# Altium project CM4_IO_Board.PrjPcb
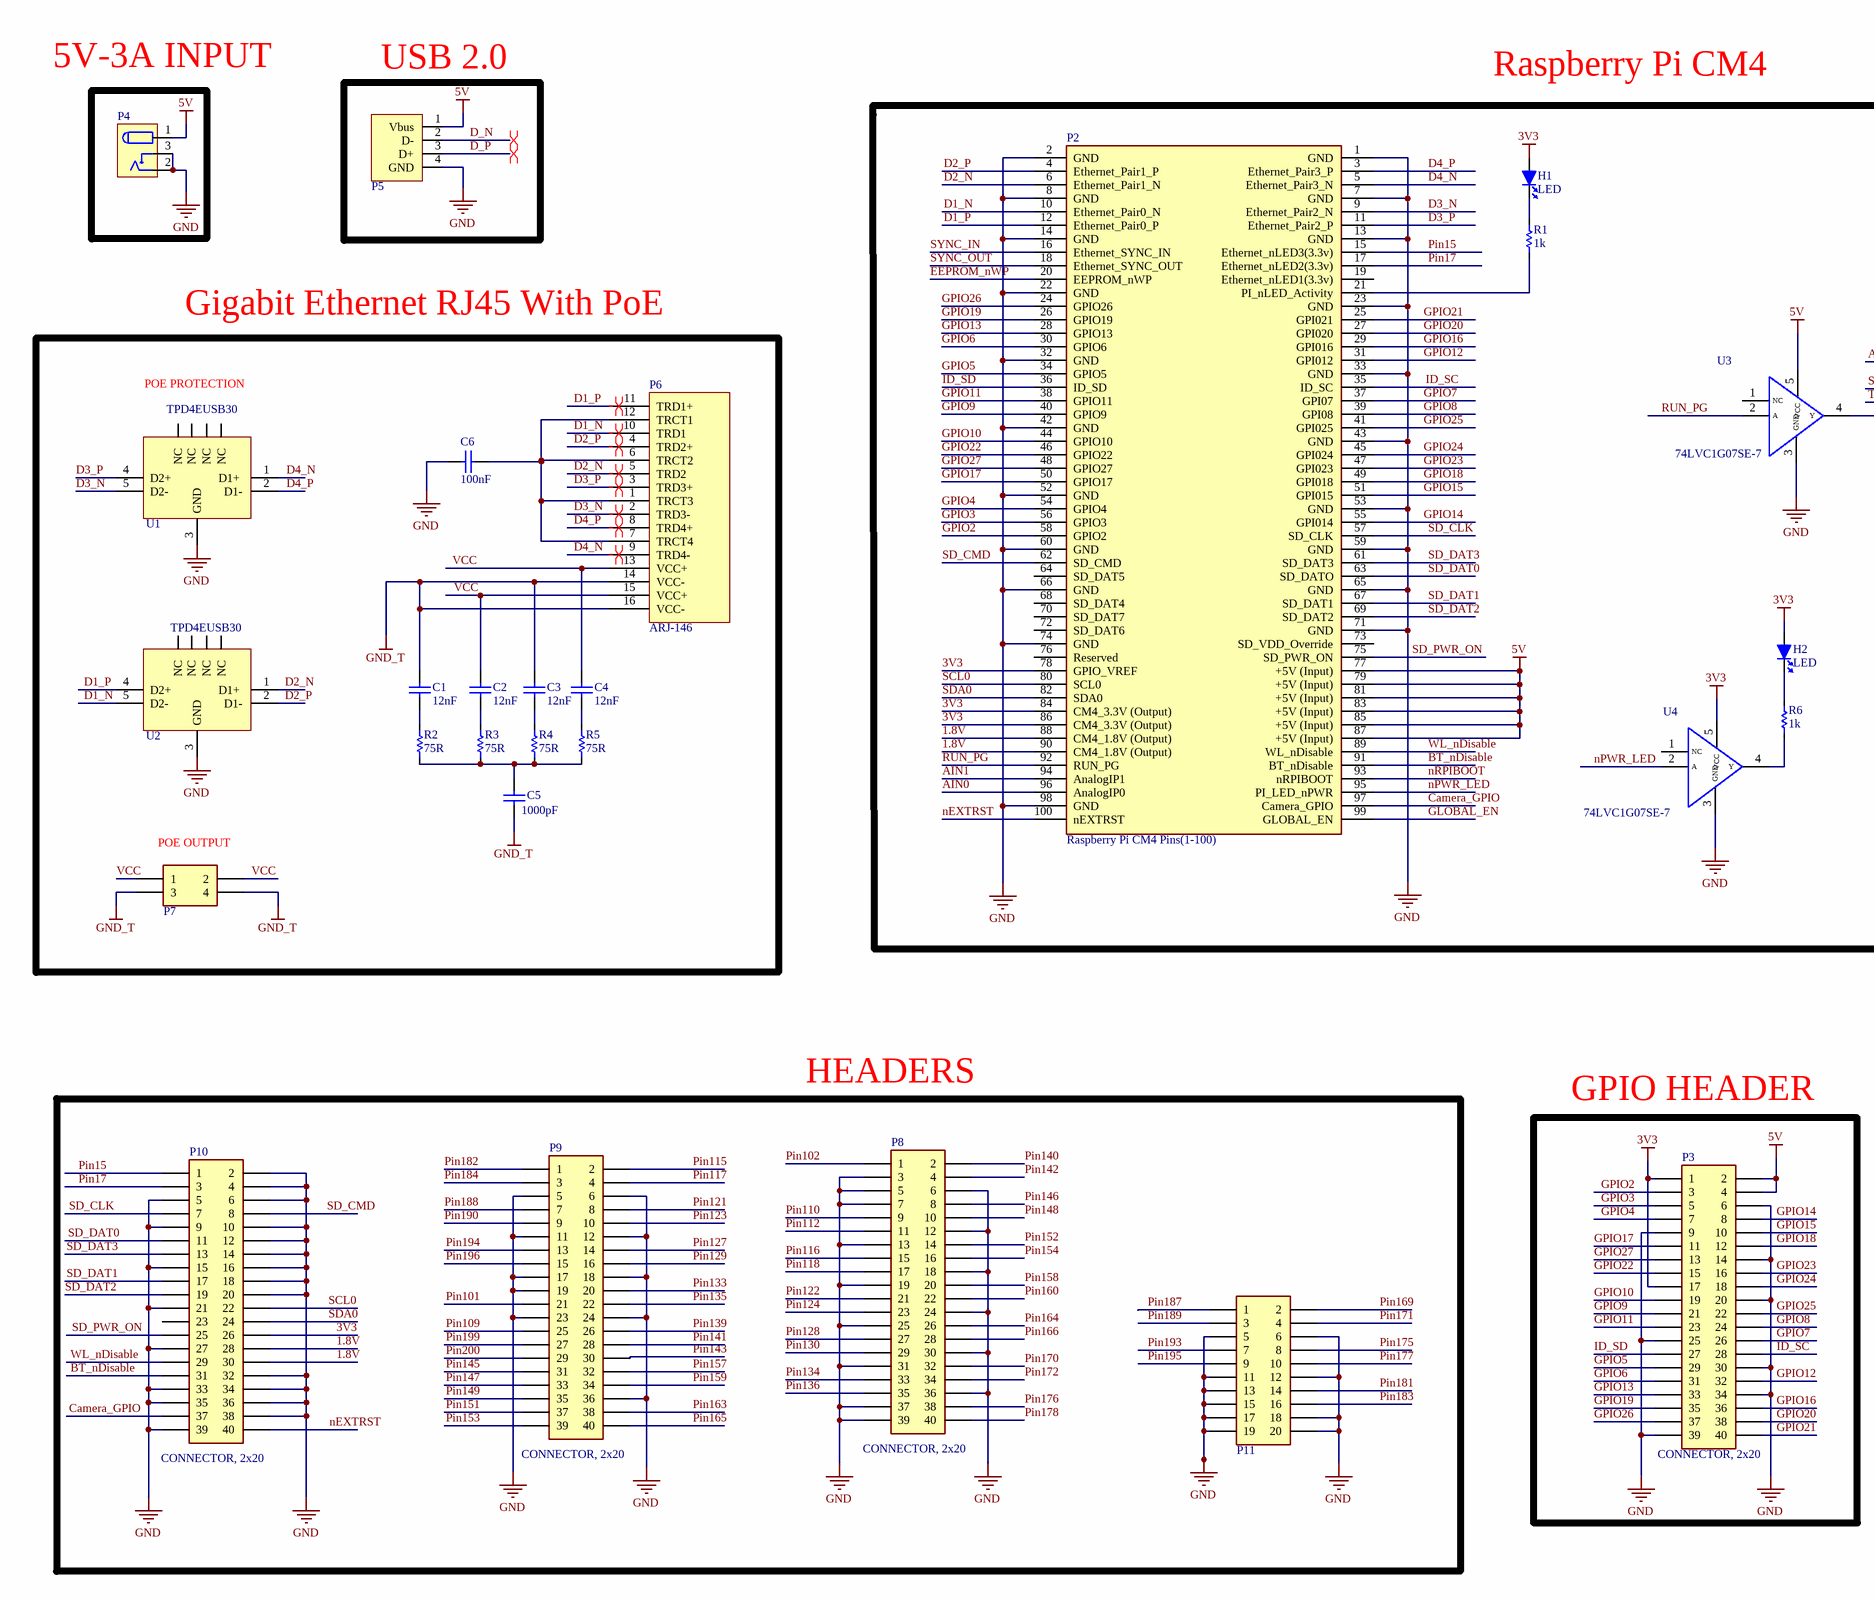
[diagram p0: Sheet1.SchDoc, left]
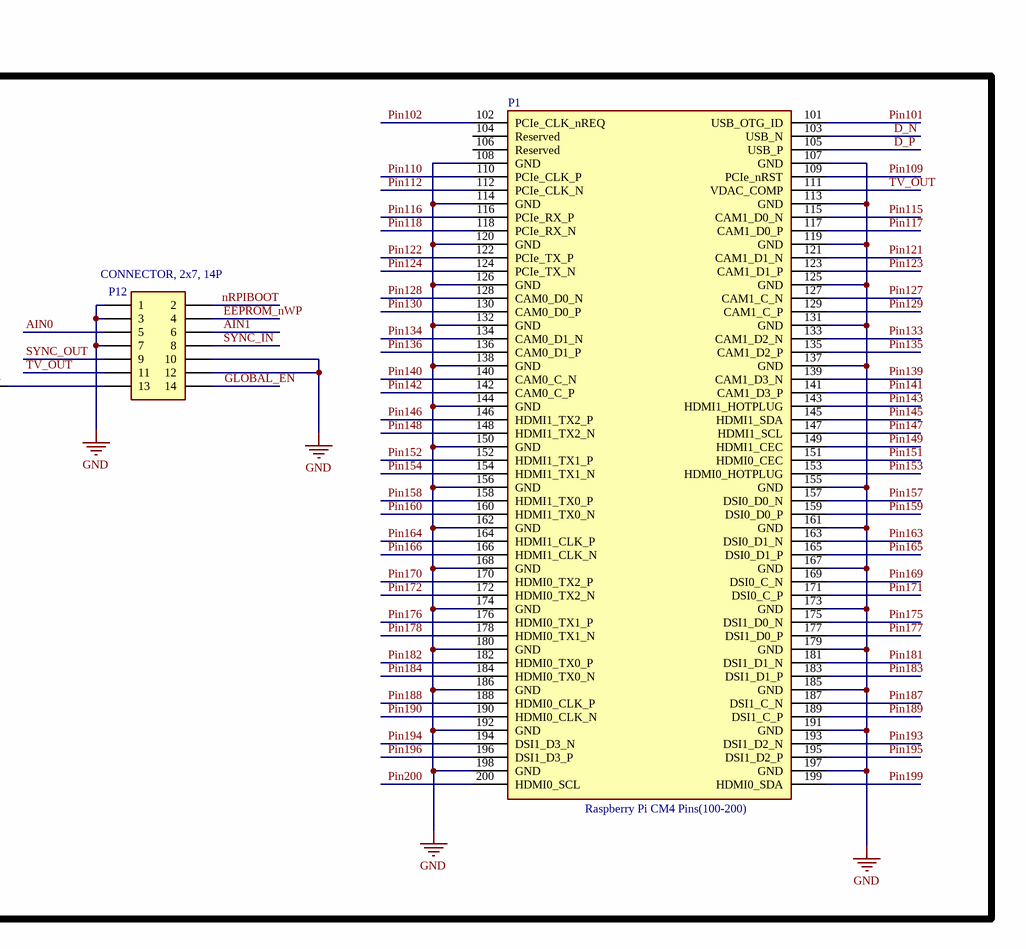
[diagram p1: Sheet1.SchDoc, right]
2 sheets, 30 parts. Net scope: global (net labels, ports and power ports of the same name join across sheets).
Board file: Pcb.PcbDoc
Sheets:
  Sheet1.SchDoc
  Sheet2.SchDoc

## Sheet Sheet1.SchDoc
size A2; SheetNumber: 1; SheetTotal: 2

### Parts
C1  12nF  [CC1608-0603L]
C2  12nF  [CC1608-0603L]
C3  12nF  [CC1608-0603L]
C4  12nF  [CC1608-0603L]
C5  1000pF  [CC3225-1210L]
C6  100nF  [CC1608-0603L]
H1  LED  [LED0805]
H2  LED  [LED0805]
P1  Raspberry Pi CM4 Pins(100-200)  [(2)HRS_DF40HC(3.0)-100DS-0.4P(2)]
P2  Raspberry Pi CM4 Pins(1-100)  [HRS_DF40HC(3.0)-100DS-0.4P - duplicate]
P3  CONNECTOR, 2x20  [HDR_FEMALE_2.54MM_2x20_40P]
P4  CONNECTOR_BARREL_JACK  [PowerJack_GCT_DCJ200-10-A-XX-K_REVA]  (value not drawn)
P5  61400416021  [61400416021]  (value not drawn)
P6  ARJ-146  [ARJ-146]
P7  CONNECTOR, 2x2, 4P  [HDR_MALE_2X2_4P_2.54MM_180]  (value not drawn)
P8  CONNECTOR, 2x20  [HDR_FEMALE_2.54MM_2x20_40P]
P9  CONNECTOR, 2x20  [HDR_FEMALE_2.54MM_2x20_40P]
P10  CONNECTOR, 2x20  [HDR_FEMALE_2.54MM_2x20_40P]
P11  CONNECTOR, 2x10, 20P  [HDR_MALE_2X10_20P_2.54MM_180]  (value not drawn)
P12  CONNECTOR, 2x7, 14P  [HDR_MALE_2X7_14P_2.54MM_180]
R1  1k  [CR1608-0603L]
R2  75R  [CR3216-1206l]
R3  75R  [CR3216-1206l]
R4  75R  [CR3216-1206l]
R5  75R  [CR3216-1206l]
R6  1k  [CR1608-0603L]
U1  TPD4EUSB30  [USON50P250X55-10N]
U2  TPD4EUSB30  [USON50P250X55-10N]
U3  74LVC1G07SE-7  [SOT35365P215X100-5N]
U4  74LVC1G07SE-7  [SOT35365P215X100-5N]

### Blocks framed on the sheet
USB 2.0: P5
Gigabit Ethernet RJ45 With PoE: C1-C6 P6 P7 R2-R5 U1 U2
HEADERS: P8-P11
GPIO HEADER: P3

### Nets
3V3: H1.1(ANODE) H2.1(ANODE) P2.78(GPIO_VREF) P2.84(CM4_3.3V_(Output)) P2.86(CM4_3.3V_(Output)) P3.1 P3.17 P10.26 U4.5(VCC)
5V: P2.77(+5V_(Input)) P2.79(+5V_(Input)) P2.81(+5V_(Input)) P2.83(+5V_(Input)) P2.85(+5V_(Input)) P2.87(+5V_(Input)) P3.2 P3.4 P4.1 P5.1(Vbus) U3.5(VCC)
GND: C6.1 P1.107(GND) P1.108(GND) P1.113(GND) P1.114(GND) P1.119(GND) P1.120(GND) P1.125(GND) P1.126(GND) P1.131(GND) P1.132(GND) P1.137(GND) P1.138(GND) P1.144(GND) P1.150(GND) P1.155(GND) P1.156(GND) P1.161(GND) P1.162(GND) P1.167(GND) P1.168(GND) P1.173(GND) P1.174(GND) P1.179(GND) P1.180(GND) P1.185(GND) P1.186(GND) P1.191(GND) P1.192(GND) P1.197(GND) P1.198(GND) P2.1(GND) P2.2(GND) P2.7(GND) P2.8(GND) P2.13(GND) P2.14(GND) P2.22(GND) P2.23(GND) P2.32(GND) P2.33(GND) P2.42(GND) P2.43(GND) P2.52(GND) P2.53(GND) P2.59(GND) P2.60(GND) P2.65(GND) P2.66(GND) P2.71(GND) P2.74(GND) P2.98(GND) P3.6 P3.9 P3.14 P3.20 P3.25 P3.30 P3.34 P3.39 P4.2 P4.3 P5.4(GND) P8.3 P8.5 P8.6 P8.7 P8.12 P8.13 P8.18 P8.19 P8.24 P8.25 P8.30 P8.31 P8.36 P8.37 P8.39 P9.5 P9.6 P9.11 P9.12 P9.17 P9.18 P9.19 P9.23 P9.24 P9.36 P10.2 P10.4 P10.5 P10.6 P10.9 P10.10 P10.12 P10.14 P10.15 P10.16 P10.18 P10.20 P10.21 P10.27 P10.32 P10.33 P10.34 P10.35 P10.36 P10.38 P10.39 P11.5 P11.6 P11.11 P11.12 P11.13 P11.15 P11.17 P11.18 P11.19 P11.20 P12.1 P12.3 P12.7 P12.10 P12.12 U1.3(GND) U2.3(GND) U3.3(GND) U4.3(GND)
GND_T: C1.1 C3.1 C5.2 P6.14(VCC-) P6.16(VCC-) P7.3 P7.4
1.8V: P2.88(CM4_1.8V_(Output)) P2.90(CM4_1.8V_(Output)) P10.28 P10.30
AIN0: P2.96(AnalogIP0) P12.5
AIN1: P2.94(AnalogIP1) P12.6
BT_nDisable: P2.91(BT_nDisable) P10.31
Camera_GPIO: P2.97(Camera_GPIO) P10.37
D1_N: P2.10(Ethernet_Pair0_N) P6.10(TRD1) U2.5(D2-)
D1_P: P2.12(Ethernet_Pair0_P) P6.11(TRD1+) U2.4(D2+)
D2_N: P2.6(Ethernet_Pair1_N) P6.5(TRD2) U2.1(D1+)
D2_P: P2.4(Ethernet_Pair1_P) P6.4(TRD2+) U2.2(D1-)
D3_N: P2.9(Ethernet_Pair2_N) P6.2(TRD3-) U1.5(D2-)
D3_P: P2.11(Ethernet_Pair2_P) P6.3(TRD3+) U1.4(D2+)
D4_N: P2.5(Ethernet_Pair3_N) P6.9(TRD4-) U1.1(D1+)
D4_P: P2.3(Ethernet_Pair3_P) P6.8(TRD4+) U1.2(D1-)
D_N: P1.103(USB_N) P5.2(D-)
D_P: P1.105(USB_P) P5.3(D+)
EEPROM_nWP: P2.20(EEPROM_nWP) P12.4
GLOBAL_EN: P2.99(GLOBAL_EN) P12.14
GPIO2: P2.58(GPIO2) P3.3
GPIO3: P2.56(GPIO3) P3.5
GPIO4: P2.54(GPIO4) P3.7
GPIO5: P2.34(GPIO5) P3.29
GPIO6: P2.30(GPIO6) P3.31
GPIO7: P2.37(GPI07) P3.26
GPIO8: P2.39(GPI08) P3.24
GPIO9: P2.40(GPIO9) P3.21
GPIO10: P2.44(GPIO10) P3.19
GPIO11: P2.38(GPIO11) P3.23
GPIO12: P2.31(GPI012) P3.32
GPIO13: P2.28(GPIO13) P3.33
GPIO14: P2.55(GPI014) P3.8
GPIO15: P2.51(GPI015) P3.10
GPIO16: P2.29(GPI016) P3.36
GPIO17: P2.50(GPIO17) P3.11
GPIO18: P2.49(GPI018) P3.12
GPIO19: P2.26(GPIO19) P3.35
GPIO20: P2.27(GPI020) P3.38
GPIO21: P2.25(GPI021) P3.40
GPIO22: P2.46(GPIO22) P3.15
GPIO23: P2.47(GPI023) P3.16
GPIO24: P2.45(GPI024) P3.18
GPIO25: P2.41(GPI025) P3.22
GPIO26: P2.24(GPIO26) P3.37
GPIO27: P2.48(GPIO27) P3.13
ID_SC: P2.35(ID_SC) P3.28
ID_SD: P2.36(ID_SD) P3.27
nEXTRST: P2.100(nEXTRST) P10.40
nPWR_LED: P2.95(PI_LED_nPWR) U4.2(A)
nRPIBOOT: P2.93(nRPIBOOT) P12.2
Pin15: P2.15(Ethernet_nLED3(3.3v)) P10.1
Pin17: P2.17(Ethernet_nLED2(3.3v)) P10.3
Pin101: P1.101(USB_OTG_ID) P9.21
Pin102: P1.102(PCIe_CLK_nREQ) P8.1
Pin109: P1.109(PCIe_nRST) P9.25
Pin110: P1.110(PCIe_CLK_P) P8.9
Pin112: P1.112(PCIe_CLK_N) P8.11
Pin115: P1.115(CAM1_D0_N) P9.2
Pin116: P1.116(PCIe_RX_P) P8.15
Pin117: P1.117(CAM1_D0_P) P9.4
Pin118: P1.118(PCIe_RX_N) P8.17
Pin121: P1.121(CAM1_D1_N) P9.8
Pin122: P1.122(PCIe_TX_P) P8.21
Pin123: P1.123(CAM1_D1_P) P9.10
Pin124: P1.124(PCIe_TX_N) P8.23
Pin127: P1.127(CAM1_C_N) P9.14
Pin128: P1.128(CAM0_D0_N) P8.27
Pin129: P1.129(CAM1_C_P) P9.16
Pin130: P1.130(CAM0_D0_P) P8.29
Pin133: P1.133(CAM1_D2_N) P9.20
Pin134: P1.134(CAM0_D1_N) P8.33
Pin135: P1.135(CAM1_D2_P) P9.22
Pin136: P1.136(CAM0_D1_P) P8.35
Pin139: P1.139(CAM1_D3_N) P9.26
Pin140: P1.140(CAM0_C_N) P8.2
Pin141: P1.141(CAM1_D3_P) P9.28
Pin142: P1.142(CAM0_C_P) P8.4
Pin143: P1.143(HDMI1_HOTPLUG) P9.30
Pin145: P1.145(HDMI1_SDA) P9.31
Pin146: P1.146(HDMI1_TX2_P) P8.8
Pin147: P1.147(HDMI1_SCL) P9.33
Pin148: P1.148(HDMI1_TX2_N) P8.10
Pin149: P1.149(HDMI1_CEC) P9.35
Pin151: P1.151(HDMI0_CEC) P9.37
Pin152: P1.152(HDMI1_TX1_P) P8.14
Pin153: P1.153(HDMI0_HOTPLUG) P9.39
Pin154: P1.154(HDMI1_TX1_N) P8.16
Pin157: P1.157(DSI0_D0_N) P9.32
Pin158: P1.158(HDMI1_TX0_P) P8.20
Pin159: P1.159(DSI0_D0_P) P9.34
Pin160: P1.160(HDMI1_TX0_N) P8.22
Pin163: P1.163(DSI0_D1_N) P9.38
Pin164: P1.164(HDMI1_CLK_P) P8.26
Pin165: P1.165(DSI0_D1_P) P9.40
Pin166: P1.166(HDMI1_CLK_N) P8.28
Pin169: P1.169(DSI0_C_N) P11.2
Pin170: P1.170(HDMI0_TX2_P) P8.32
Pin171: P1.171(DSI0_C_P) P11.4
Pin172: P1.172(HDMI0_TX2_N) P8.34
Pin175: P1.175(DSI1_D0_N) P11.8
Pin176: P1.176(HDMI0_TX1_P) P8.38
Pin177: P1.177(DSI1_D0_P) P11.10
Pin178: P1.178(HDMI0_TX1_N) P8.40
Pin181: P1.181(DSI1_D1_N) P11.14
Pin182: P1.182(HDMI0_TX0_P) P9.1
Pin183: P1.183(DSI1_D1_P) P11.16
Pin184: P1.184(HDMI0_TX0_N) P9.3
Pin187: P1.187(DSI1_C_N) P11.1
Pin188: P1.188(HDMI0_CLK_P) P9.7
Pin189: P1.189(DSI1_C_P) P11.3
Pin190: P1.190(HDMI0_CLK_N) P9.9
Pin193: P1.193(DSI1_D2_N) P11.7
Pin194: P1.194(DSI1_D3_N) P9.13
Pin195: P1.195(DSI1_D2_P) P11.9
Pin196: P1.196(DSI1_D3_P) P9.15
Pin199: P1.199(HDMI0_SDA) P9.27
Pin200: P1.200(HDMI0_SCL) P9.29
RUN_PG: P2.92(RUN_PG) U3.2(A)
SCL0: P2.80(SCL0) P10.22
SD_CLK: P2.57(SD_CLK) P10.7
SD_CMD: P2.62(SD_CMD) P10.8
SD_DAT0: P2.63(SD_DATO) P10.11
SD_DAT1: P2.67(SD_DAT1) P10.17
SD_DAT2: P2.69(SD_DAT2) P10.19
SD_DAT3: P2.61(SD_DAT3) P10.13
SD_PWR_ON: P2.75(SD_PWR_ON) P10.25
SDA0: P2.82(SDA0) P10.24
SYNC_IN: P2.16(Ethernet_SYNC_IN) P12.8
SYNC_OUT: P2.18(Ethernet_SYNC_OUT) P12.9
TV_OUT: P1.111(VDAC_COMP) P12.11
VCC: C2.1 C4.1 P6.13(VCC+) P6.15(VCC+) P7.1 P7.2
WL_nDisable: P2.89(WL_nDisable) P10.29
NetC1_2: C1.2 R2.2
NetC2_2: C2.2 R3.2
NetC3_2: C3.2 R4.2
NetC4_2: C4.2 R5.2
NetC5_1: C5.1 R2.1 R3.1 R4.1 R5.1
NetC6_2: C6.2 P6.1(TRCT3) P6.6(TRCT2) P6.7(TRCT4) P6.12(TRCT1)
NetH1_2: H1.2(CATHODE) R1.2
NetH2_2: H2.2(CATHODE) R6.2
NetP2_21: P2.21(PI_nLED_Activity) R1.1
NetP12_13: P12.13 U3.4(Y)
NetR6_1: R6.1 U4.4(Y)

Not connected (* = marked no-connect by the designer): P1 104(Reserved) 106(Reserved); P2 19(Ethernet_nLED1(3.3v)) 64(SD_DAT5) 68(SD_DAT4) 70(SD_DAT7) 72(SD_DAT6) 73(SD_VDD_Override) 76(Reserved); P10 23; U1 6(NC) 7(NC) 9(NC) 10(NC); U2 6(NC) 7(NC) 9(NC) 10(NC); U3 1(NC); U4 1(NC)

### Layout directives
differential pair: D1_N, D1_P, D2_N, D2_P, D3_N, D3_P, D4_N, D4_P, D_N, D_P

### Notes on the sheet
- 5V-3A INPUT
- Raspberry Pi CM4
- (near U1) POE PROTECTION
- (near P7) POE OUTPUT

### Library data of the parts
C1-C4 = CAPACITOR NON-POL: CAP CER 12nF 100V X7R 0603; Manufacturer: KYOCERA AVX; Manufacturer Part Number: 06031C123KAT2A; Supplier: Digikey; Value: 12 nF; Voltage: 100V; ComponentLink1Description: Supplier Link; ComponentLink1URL: https://www.digikey.com/en/products/detail/kyocera-avx/06031C123KAT2A/1598683
C5 = CAPACITOR NON-POL: CAP CER 1000pF 2KV X7R 1210; Manufacturer: Johanson Dielectrics Inc.; Manufacturer Part Number: VPDF202W102K1GV001E; Supplier: Digikey; Value: 1000pF; Voltage: 2 KV; ComponentLink1Description: Supplier Link; ComponentLink1URL: https://www.digikey.com/en/products/detail/johanson-dielectrics-inc/VPDF202W102K1GV001E/1556362
C6 = CAPACITOR NON-POL: MLCC (1608) 0603 100nF 50VDC ±10% X7R; Manufacturer: YAGEO; Manufacturer Part Number: CC0603KRX7R9BB104; Voltage: 50V; Supplier: Ozdisan; ComponentLink1Description: Supplier Link; ComponentLink1URL: https://www.ozdisan.com/p/smt-smd-ve-mlcc-kapasitorler-184/yageo-cc0603krx7r9bb104-476015; Value: 100nF
H1 = LED: LED SMD 0805 GREEN 18-45mcd 140° WATER CLEAR; Manufacturer: EVERLIGHT; Manufacturer Part Number: 17-21/G6C-FM1N2B/4T; Supplier: Ozdisan; ComponentLink1Description: Supplier Link; ComponentLink1URL: https://www.ozdisan.com/p/sinyal-ledler-tek-renkli-361/everlight-17-21-g6c-fm1n2b-4t-745079
H2 = LED: LED SMD 0805 RED 45~112mcd 120C; Manufacturer: EVERLIGHT; Manufacturer Part Number: 17-21/R6C-AP1Q2L/4T; Supplier: Ozdisan; ComponentLink1Description: Supplier Link; ComponentLink1URL: https://www.ozdisan.com/p/LED-Signal-Color-361/everlight-17-21-r6c-ap1q2l-4t-752951?srsltid=AfmBOoqZqmeJ3FM6HWEOiGvNNT3e6XCAh5WM331N7RK8NO8n97aDRcQ0
P1 = Raspberry Pi CM4 Pins(100-200): Connector , 2*50; Manufacturer: Hirose Electric; Manufacturer Part Number: DF40HC(3.0)-100DS-0.4V(51); Supplier: Digikey; ComponentLink1Description: Supplier Link; ComponentLink1URL: https://www.digikey.com/en/products/detail/hirose-electric-co-ltd/DF40HC-3-0-100DS-0-4V-51/4282911
P2 = Raspberry Pi CM4 Pins(1-100): Connector , 2*50; Manufacturer: Hirose Electric; Manufacturer Part Number: DF40HC(3.0)-100DS-0.4V(51); Supplier: Digikey; ComponentLink1Description: Supplier Link; ComponentLink1URL: https://www.digikey.com/en/products/detail/hirose-electric-co-ltd/DF40HC-3-0-100DS-0-4V-51/4282911
P3 P8-P10 = CONNECTOR, 2x20: CONNECTOR, 2x20, 40P; Manufacturer: Würth Elektronik; Manufacturer Part Number: 61304021821; Supplier: Digikey; ComponentLink1Description: Supplier Link; ComponentLink1URL: https://www.digikey.com/en/products/detail/w%C3%BCrth-elektronik/61304021821/16608657?s=N4IgTCBcDaIGwEYDMAGALCsCAcWQF0BfIA
P4 = CONNECTOR_BARREL_JACK: Power Barrel Connector Jack 2.05mm ID (0.081"), 5.50mm OD (0.217") Through Hole, Right Angle; Manufacturer: GCT; Manufacturer Part Number: DCJ200-10-A-K1-K; Current Rating: 5A; Voltage Rating: 20V DC; Supplier: Digikey; Supplier Part Number: 2073-DCJ200-10-A-K1-K-ND; ComponentLink1Description: Supplier Link; ComponentLink1URL: https://www.digikey.com/en/products/detail/gct/DCJ200-10-A-K1-K/9859579
P5 = 61400416021: USB-A (USB TYPE-A) USB 2.0 Receptacle Connector 4 Position Through Hole, Right Angle; Manufacturer: Würth Elektronik; Manufacturer Part Number: 61400416021; Supplier: Digikey; Supplier Part Number: 732-2106-ND; ComponentLink1Description: Supplier Link; ComponentLink1URL: https://www.digikey.com/en/products/detail/w%C3%BCrth-elektronik/61400416021/2060602; ComponentLink2Description: Datasheet Link; ComponentLink2URL: https://www.we-online.com/components/products/datasheet/61400416021.pdf
P6 = ARJ-146: 1 Port RJ45 Through Hole 10/100/1000 Base-T, AutoMDIX, Power over Ethernet (PoE); Manufacturer: Abracon LLC; ComponentLink1Description: Supplier Link; ComponentLink1URL: https://www.digikey.com/en/products/detail/abracon-llc/ARJ-146/4215225; Manufacturer Part Number: ARJ-146; Supplier: Digikey; Supplier Part Number: 535-12248-ND
P7 = CONNECTOR, 2x2, 4P: Male Header, 2x2, 4P , 2,54mm; Manufacturer: KLS ELECTRONIC; Manufacturer Part Number: L-KLS1-207-2-04-S; Supplier: Ozdisan; ComponentLink1Description: Supplier Link; ComponentLink1URL: https://www.ozdisan.com/p/pin-headerlar-293/kls-electronic-l-kls1-207-2-04-s-479018
P11 = CONNECTOR, 2x10, 20P: Manufacturer: CONNFLY; Manufacturer Part Number: DS1021-2X10SF11-B; Supplier: Ozdisan; ComponentLink1Description: Supplier Link; ComponentLink1URL: https://www.ozdisan.com/p/pin-headerlar-293/connfly-ds1021-2x10sf11-b-517240
P12 = CONNECTOR, 2x7, 14P: Manufacturer: CONNFLY; Manufacturer Part Number: DS1004-2X7F14; Supplier: Ozdisan; ComponentLink1Description: Supplier Link; ComponentLink1URL: https://www.ozdisan.com/p/pin-headerlar-293/connfly-ds1004-2x7f14-513991
R1 R6 = RESISTOR: RES.(1608) 0603 1K Ohms 5% 1/10W 100PPM SMT; Manufacturer: YAGEO; Manufacturer Part Number: RC0603JR-071KL; Voltage: 75V; Supplier: Ozdisan; Value: 1k; ComponentLink1Description: Supplier Link; ComponentLink1URL: https://www.ozdisan.com/p/smt-smd-ve-cip-direncler-194/royalohm-1206s4j0750t5e-344157
R2-R5 = RESISTOR: RES.(3216) 1206 75 Ohms 5% 1/4W-S 200PPM; Manufacturer: ROYALOHM; Manufacturer Part Number: 1206S4J0750T5E; Voltage: 200V; Supplier: Ozdisan; Value: 75R; ComponentLink1Description: Supplier Link; ComponentLink1URL: https://www.ozdisan.com/p/smt-smd-ve-cip-direncler-194/royalohm-1206s4j0750t5e-344157
U1 U2 = TPD4EUSB30: TVS DIODE 5.5VWM 8VC 10USON; Manufacturer: Texas Instruments; Manufacturer Part Number: TPD4EUSB30DQAR; ComponentLink1Description: Supplier Link; ComponentLink1URL: https://www.digikey.com/en/products/detail/texas-instruments/TPD4EUSB30DQAR/2503665?gclsrc=aw.ds&gad_source=1&gad_campaignid=21513785267&gbraid=0AAAAADrbLlhmse0gU-719uq6pgEek2vGd&gclid=Cj0KCQiA5uDIBhDAARIsAOxj0CHcWiQOA9y2CuA4wFcjfeBFD6P3JbBPSUPRAe0RB6YW1ubCTJxUprkaAkftEALw_wcB; Supplier: Digikey
U3 U4 = 74LVC1G07SE-7: IC BUF NON-INVERT 5.5V; Manufacturer: DIODES; Manufacturer Part Number: 74LVC1G07SE-7; Supplier: Ozdisan; ComponentLink1Description: Supplier Link; ComponentLink1URL: https://www.ozdisan.com/p/Buffers-Drivers-Receivers-and-Transceivers-244/diodes-74lvc1g07se-7-702869?srsltid=AfmBOooBFdMJnXkx3yepfLdhY9BiT5jz5IJDo2REhXwX1lrIa2-bRsec

## Sheet Sheet2.SchDoc
size A3; SheetNumber: 2; SheetTotal: 2
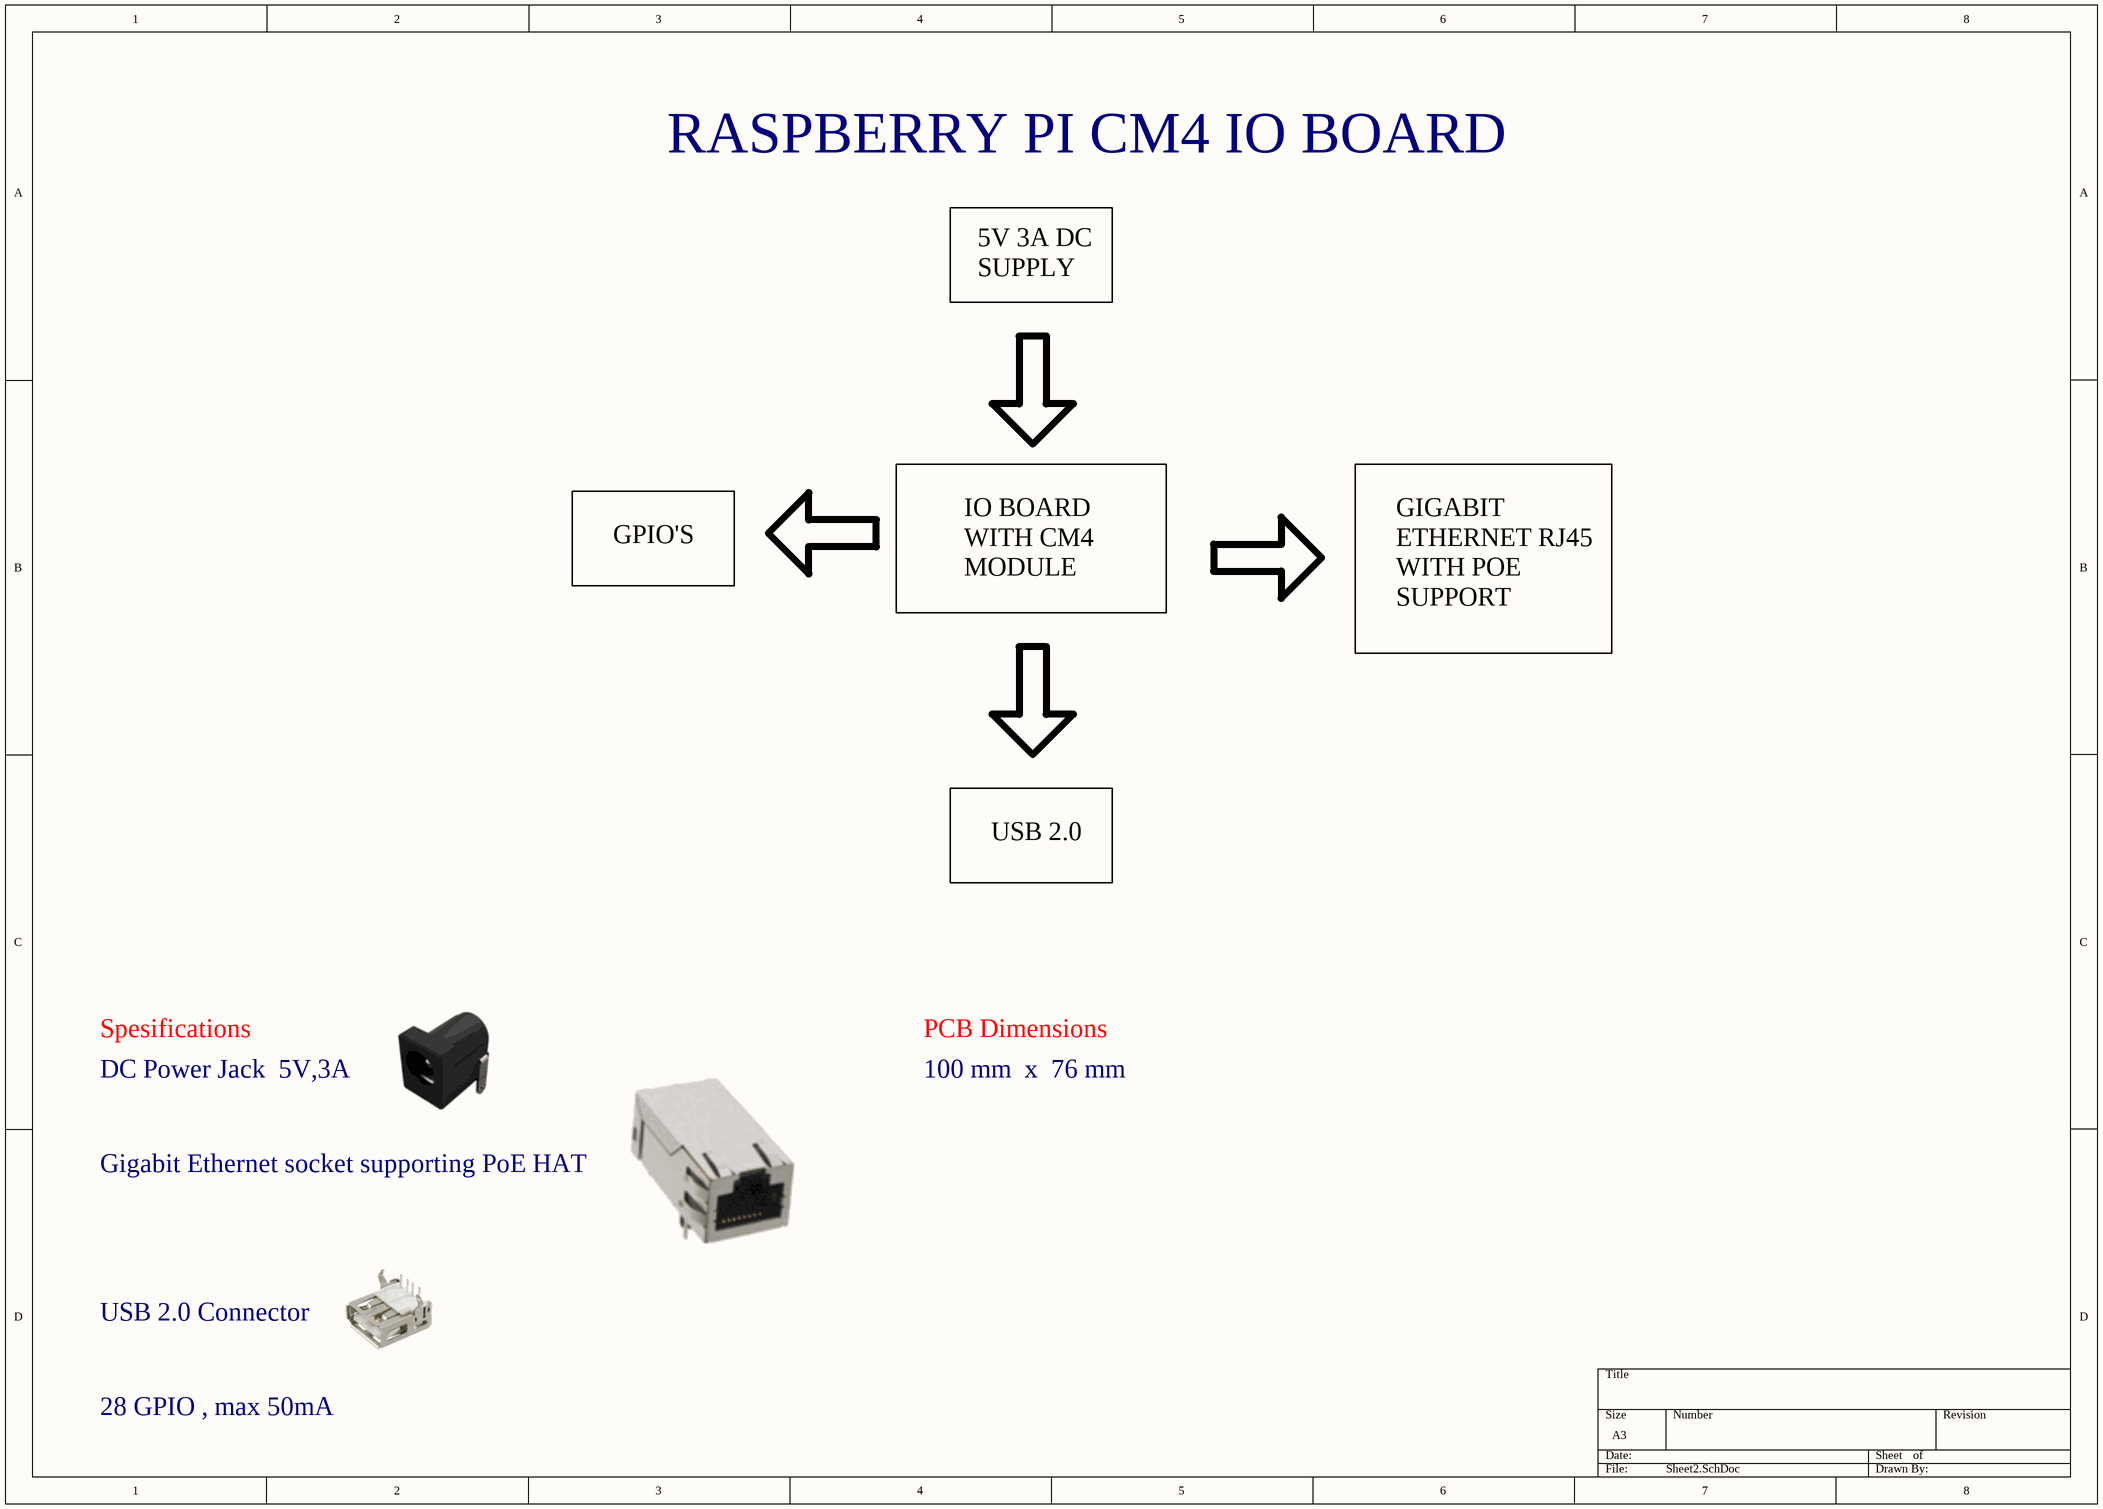
[diagram p2: Sheet2.SchDoc]

### Notes on the sheet
- RASPBERRY PI CM4 IO BOARD
- 5V 3A DC SUPPLY
- GPIO'S
- IO BOARD
  WITH CM4 MODULE
- GIGABIT ETHERNET RJ45 WITH POE SUPPORT
- USB 2.0
- Spesifications
- PCB Dimensions
- DC Power Jack  5V,3A
- 100 mm  x  76 mm
- Gigabit Ethernet socket supporting PoE HAT
- USB 2.0 Connector
- 28 GPIO , max 50mA